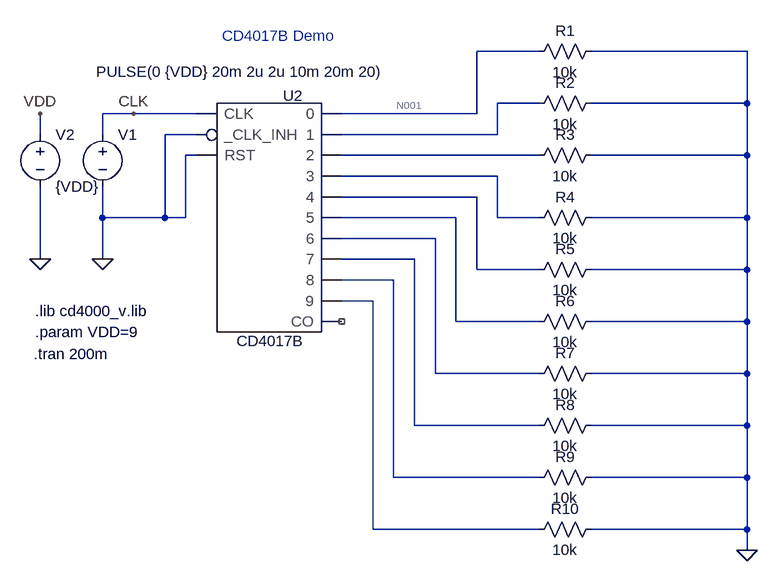
[diagram p0: schematic CD4017BDemo.asc]
CD4017BDemo.asc, the LTspice schematic file:
Version 4
SHEET 1 1320 836
WIRE 880 48 784 48
WIRE 1200 48 960 48
WIRE 880 128 816 128
WIRE 1200 128 1200 48
WIRE 1200 128 960 128
WIRE 256 144 208 144
WIRE 352 144 256 144
WIRE 784 144 784 48
WIRE 784 144 576 144
WIRE 112 176 112 144
WIRE 208 176 208 144
WIRE 352 176 304 176
WIRE 816 176 816 128
WIRE 816 176 576 176
WIRE 352 208 336 208
WIRE 880 208 576 208
WIRE 1200 208 1200 128
WIRE 1200 208 960 208
WIRE 816 240 576 240
WIRE 784 272 576 272
WIRE 208 304 208 256
WIRE 304 304 304 176
WIRE 304 304 208 304
WIRE 336 304 336 208
WIRE 336 304 304 304
WIRE 752 304 576 304
WIRE 816 304 816 240
WIRE 880 304 816 304
WIRE 1200 304 1200 208
WIRE 1200 304 960 304
WIRE 720 336 576 336
WIRE 112 368 112 256
WIRE 208 368 208 304
WIRE 688 368 576 368
WIRE 784 384 784 272
WIRE 880 384 784 384
WIRE 1200 384 1200 304
WIRE 1200 384 960 384
WIRE 656 400 576 400
WIRE 624 432 576 432
WIRE 752 464 752 304
WIRE 880 464 752 464
WIRE 1200 464 1200 384
WIRE 1200 464 960 464
WIRE 720 544 720 336
WIRE 880 544 720 544
WIRE 1200 544 1200 464
WIRE 1200 544 960 544
WIRE 688 624 688 368
WIRE 880 624 688 624
WIRE 1200 624 1200 544
WIRE 1200 624 960 624
WIRE 656 704 656 400
WIRE 880 704 656 704
WIRE 1200 704 1200 624
WIRE 1200 704 960 704
WIRE 624 784 624 432
WIRE 880 784 624 784
WIRE 1200 784 1200 704
WIRE 1200 784 960 784
WIRE 1200 816 1200 784
FLAG 208 368 0
FLAG 112 368 0
FLAG 112 144 VDD
FLAG 1200 816 0
FLAG 256 144 CLK
SYMBOL CD4017B 464 288 R0
SYMATTR InstName U2
SYMBOL voltage 208 160 R0
WINDOW 3 -10 -81 Left 2
WINDOW 123 0 0 Left 2
WINDOW 39 0 0 Left 2
SYMATTR InstName V1
SYMATTR Value PULSE(0 {VDD} 20m 2u 2u 10m 20m 20)
SYMBOL voltage 112 160 R0
SYMATTR InstName V2
SYMATTR Value {VDD}
SYMBOL res 864 64 R270
WINDOW 0 32 56 VTop 2
WINDOW 3 0 56 VBottom 2
SYMATTR InstName R1
SYMATTR Value 10k
SYMBOL res 864 144 R270
WINDOW 0 32 56 VTop 2
WINDOW 3 0 56 VBottom 2
SYMATTR InstName R2
SYMATTR Value 10k
SYMBOL res 864 224 R270
WINDOW 0 32 56 VTop 2
WINDOW 3 0 56 VBottom 2
SYMATTR InstName R3
SYMATTR Value 10k
SYMBOL res 864 320 R270
WINDOW 0 32 56 VTop 2
WINDOW 3 0 56 VBottom 2
SYMATTR InstName R4
SYMATTR Value 10k
SYMBOL res 864 400 R270
WINDOW 0 32 56 VTop 2
WINDOW 3 0 56 VBottom 2
SYMATTR InstName R5
SYMATTR Value 10k
SYMBOL res 864 480 R270
WINDOW 0 32 56 VTop 2
WINDOW 3 0 56 VBottom 2
SYMATTR InstName R6
SYMATTR Value 10k
SYMBOL res 864 560 R270
WINDOW 0 32 56 VTop 2
WINDOW 3 0 56 VBottom 2
SYMATTR InstName R7
SYMATTR Value 10k
SYMBOL res 864 640 R270
WINDOW 0 32 56 VTop 2
WINDOW 3 0 56 VBottom 2
SYMATTR InstName R8
SYMATTR Value 10k
SYMBOL res 864 720 R270
WINDOW 0 32 56 VTop 2
WINDOW 3 0 56 VBottom 2
SYMATTR InstName R9
SYMATTR Value 10k
SYMBOL res 864 800 R270
WINDOW 0 32 56 VTop 2
WINDOW 3 0 56 VBottom 2
SYMATTR InstName R10
SYMATTR Value 10k
TEXT 102 514 Left 2 !.tran 200m
TEXT 104 448 Left 2 !.lib cd4000_v.lib
TEXT 104 480 Left 2 !.param VDD=9
TEXT 392 24 Left 2 ;CD4017B Demo

The netlist it stands for:
* CD4017BDemo.asc
XU2 0 0 CLK N001 N002 N003 N004 N005 N006 N007 N008 N009 N010 NC_01 VDD 0 CD4017B VDD=5  SPEED=1.0  TRIPDT=5e-9  ; pins MR CPN CP Q0 Q1 Q2 Q3 Q4 Q5 Q6 Q7 Q8 Q9 Q59
V1 CLK 0 PULSE(0 {VDD} 20m 2u 2u 10m 20m 20)
V2 VDD 0 {VDD}
R1 N001 0 10k
R2 N002 0 10k
R3 N003 0 10k
R4 N004 0 10k
R5 N005 0 10k
R6 N006 0 10k
R7 N007 0 10k
R8 N008 0 10k
R9 N009 0 10k
R10 N010 0 10k
.tran 200m
.lib cd4000_v.lib
.param VDD=9
* CD4017B Demo
.backanno
.end

* Results of the author's LTspice run, read from the files saved beside the schematic
* Operating Point, zero values left out:
*   V(n001) = 4.762 V
*   V(vdd) = 9 V
*   I(R1) = 476.2 µA
*   Ix(u2:O0) = -476.2 µA
*   Ix(u2:VGND) = 476.2 µA
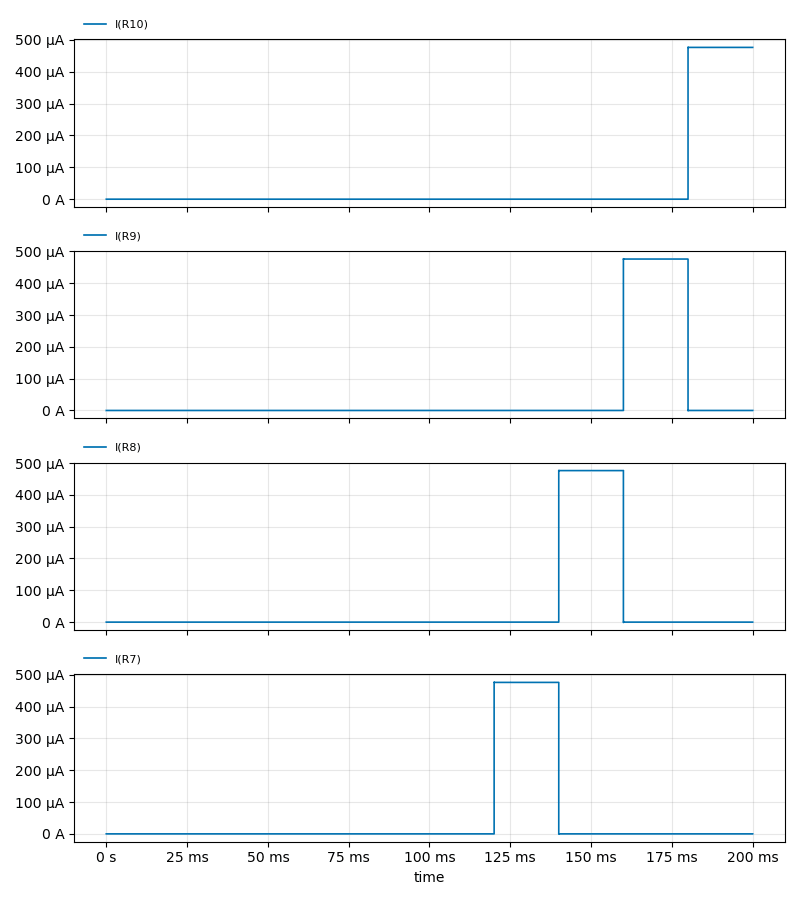
[diagram p1: Transient Analysis of CD4017BDemo.asc, plotted from the saved traces]
* Transient Analysis, 1 run:
*   I(R10): min 0 A, max 477.3 µA, average 47.62 µA, rms 150.6 µA, last 476.2 µA
*   I(R9): min -1.105 µA, max 477.3 µA, average 47.62 µA, rms 150.6 µA, last 0 A
*   I(R8): min -1.105 µA, max 477 µA, average 47.62 µA, rms 150.6 µA, last 0 A
*   I(R7): min -774.5 nA, max 477.3 µA, average 47.62 µA, rms 150.6 µA, last 0 A